# EAGLE schematic stepper_control_board (EAGLE 6.1)
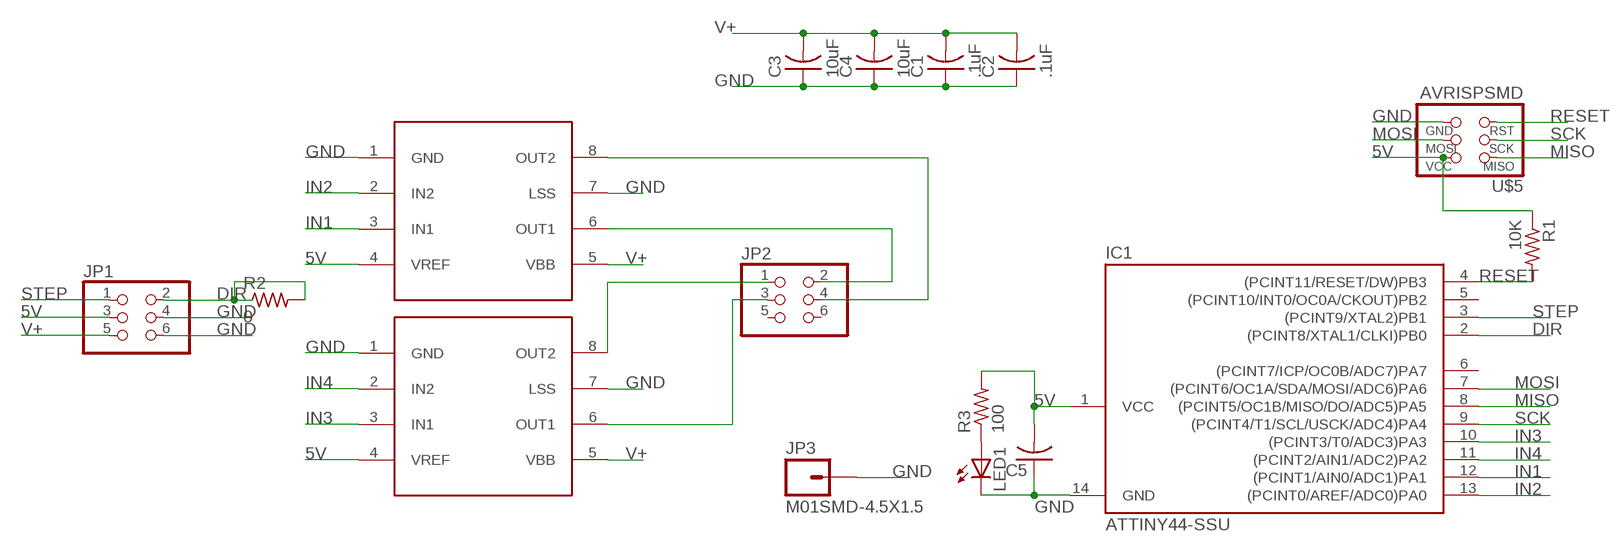
[diagram p0: schematic, sheet 1]

## Parts
C1  .1uF  CAP-US1206FAB  [C1206FAB]
C2  .1uF  CAP-US1206FAB  [C1206FAB]
C3  10uF  CAP-US1206FAB  [C1206FAB]
C4  10uF  CAP-US1206FAB  [C1206FAB]
C5  C-USC1206  [C1206]
IC1  ATTINY44-SSU  [SOIC14]
JP1  PINHD-2X3-SMD  [2X03SMD]
JP2  PINHD-2X3-SMD  [2X03SMD]
JP3  M01SMD-4.5X1.5  [PAD-1.5X4.5]
LED1  LED1206  [LED-1206]
R1  10K  RES-US1206FAB  [R1206FAB]
R2  0  RES-US1206FAB  [R1206FAB]
R3  100  RES-US1206FAB  [R1206FAB]
U$1  A4953-H-BRIDGE-MOTOR-DRIVER  [SOIC8]
U$2  A4953-H-BRIDGE-MOTOR-DRIVER  [SOIC8]
U$5  AVRISPSMD  [2X03SMD]

## Nets
5V: C5.2 IC1.1(VCC) JP1.3 R1.1 R3.2 U$1.4(VREF) U$2.4(VREF) U$5.2(VCC)
DIR: IC1.2((PCINT8/XTAL1/CLKI)PB0) JP1.2 R2.1 R2.2
GND: C1.1 C2.1 C3.1 C4.1 C5.1 IC1.14(GND) JP1.4 JP1.6 JP3.P$1 LED1.C U$1.1(GND) U$1.7(LSS) U$2.1(GND) U$2.7(LSS) U$5.6(GND)
IN1: IC1.12((PCINT1/AIN0/ADC1)PA1) U$1.3(IN1)
IN2: IC1.13((PCINT0/AREF/ADC0)PA0) U$1.2(IN2)
IN3: IC1.10((PCINT3/T0/ADC3)PA3) U$2.3(IN1)
IN4: IC1.11((PCINT2/AIN1/ADC2)PA2) U$2.2(IN2)
MISO: IC1.8((PCINT5/OC1B/MISO/DO/ADC5)PA5) U$5.1(MISO)
MOSI: IC1.7((PCINT6/OC1A/SDA/MOSI/ADC6)PA6) U$5.4(MOSI)
N$1: JP2.1 U$2.8(OUT2)
N$2: JP2.3 U$2.6(OUT1)
N$3: JP2.4 U$1.8(OUT2)
N$4: LED1.A R3.1
N$6: JP2.2 U$1.6(OUT1)
RESET: IC1.4((PCINT11/RESET/DW)PB3) R1.2 U$5.5(RST)
SCK: IC1.9((PCINT4/T1/SCL/USCK/ADC4)PA4) U$5.3(SCK)
STEP: IC1.3((PCINT9/XTAL2)PB1) JP1.1
V+: C1.2 C2.2 C3.2 C4.2 JP1.5 U$1.5(VBB) U$2.5(VBB)
Unconnected: IC1.5((PCINT10/INT0/OC0A/CKOUT)PB2) IC1.6((PCINT7/ICP/OC0B/ADC7)PA7) JP2.5 JP2.6

## Library data of the parts
C1-C4 = fab:CAP-US
C5 = adafruit:C-US: CAPACITOR, American symbol
IC1 = fab:ATTINY44
JP1 JP2 = fab:PINHD-2X3-SMD: PIN HEADER
JP3 = SparkFun:M01: Header 1 Standard 1-pin 0.1" header. Use with straight break away headers (SKU : PRT-00116), right angle break away headers (PRT-00553), swiss pins (PRT-00743), machine pins (PRT-00117), and female headers (PRT-00115).
LED1 = SparkFun:LED: LEDs Standard schematic elements and footprints for 5mm, 3mm, 1206, and 0603 sized LEDs. 5mm - Spark Fun Electronics SKU : COM-00529 (and others)
R1-R3 = fab:RES-US: Resistor (US Symbol) Variants with postfix FAB are widened to allow the routing of internal traces
U$1 U$2 = fab:A4953-H-BRIDGE-MOTOR-DRIVER
U$5 = fab:AVRISP